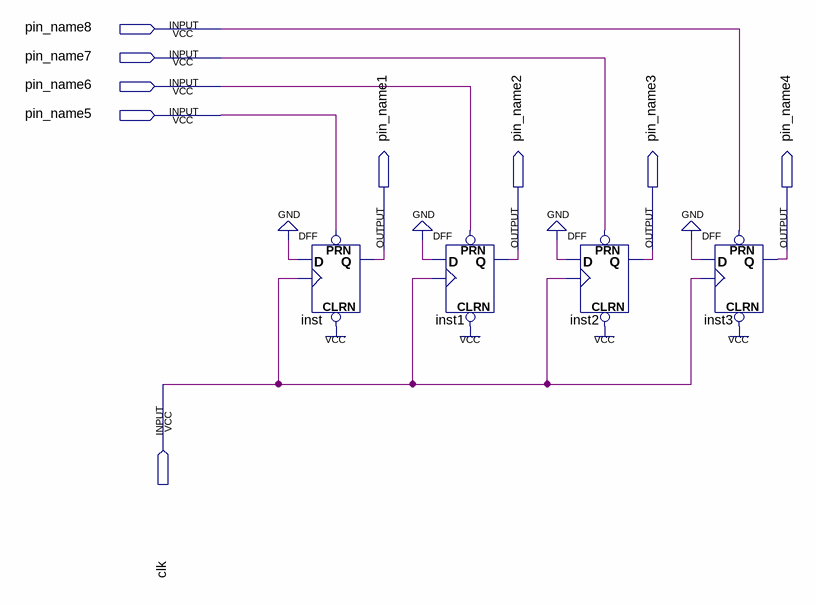
[diagram p0: schematic sheet]
// Quartus schematic teste_reg.bdf as structural Verilog: 4 symbols, 9 pins
module teste_reg (
  input  pin_name8,
  input  pin_name7,
  input  pin_name6,
  input  pin_name5,
  input  clk,
  output pin_name1,
  output pin_name2,
  output pin_name3,
  output pin_name4
);

  DFF inst (.CLRN(1'b1), .CLK(clk), .D(1'b0), .PRN(pin_name5), .Q(pin_name1));
  DFF inst1 (.CLRN(1'b1), .CLK(clk), .D(1'b0), .PRN(pin_name6), .Q(pin_name2));
  DFF inst2 (.CLRN(1'b1), .CLK(clk), .D(1'b0), .PRN(pin_name7), .Q(pin_name3));
  DFF inst3 (.CLRN(1'b1), .CLK(clk), .D(1'b0), .PRN(pin_name8), .Q(pin_name4));
endmodule
